# EAGLE schematic Orbiter_ENCODER_V4_0 (EAGLE 9.0.1)
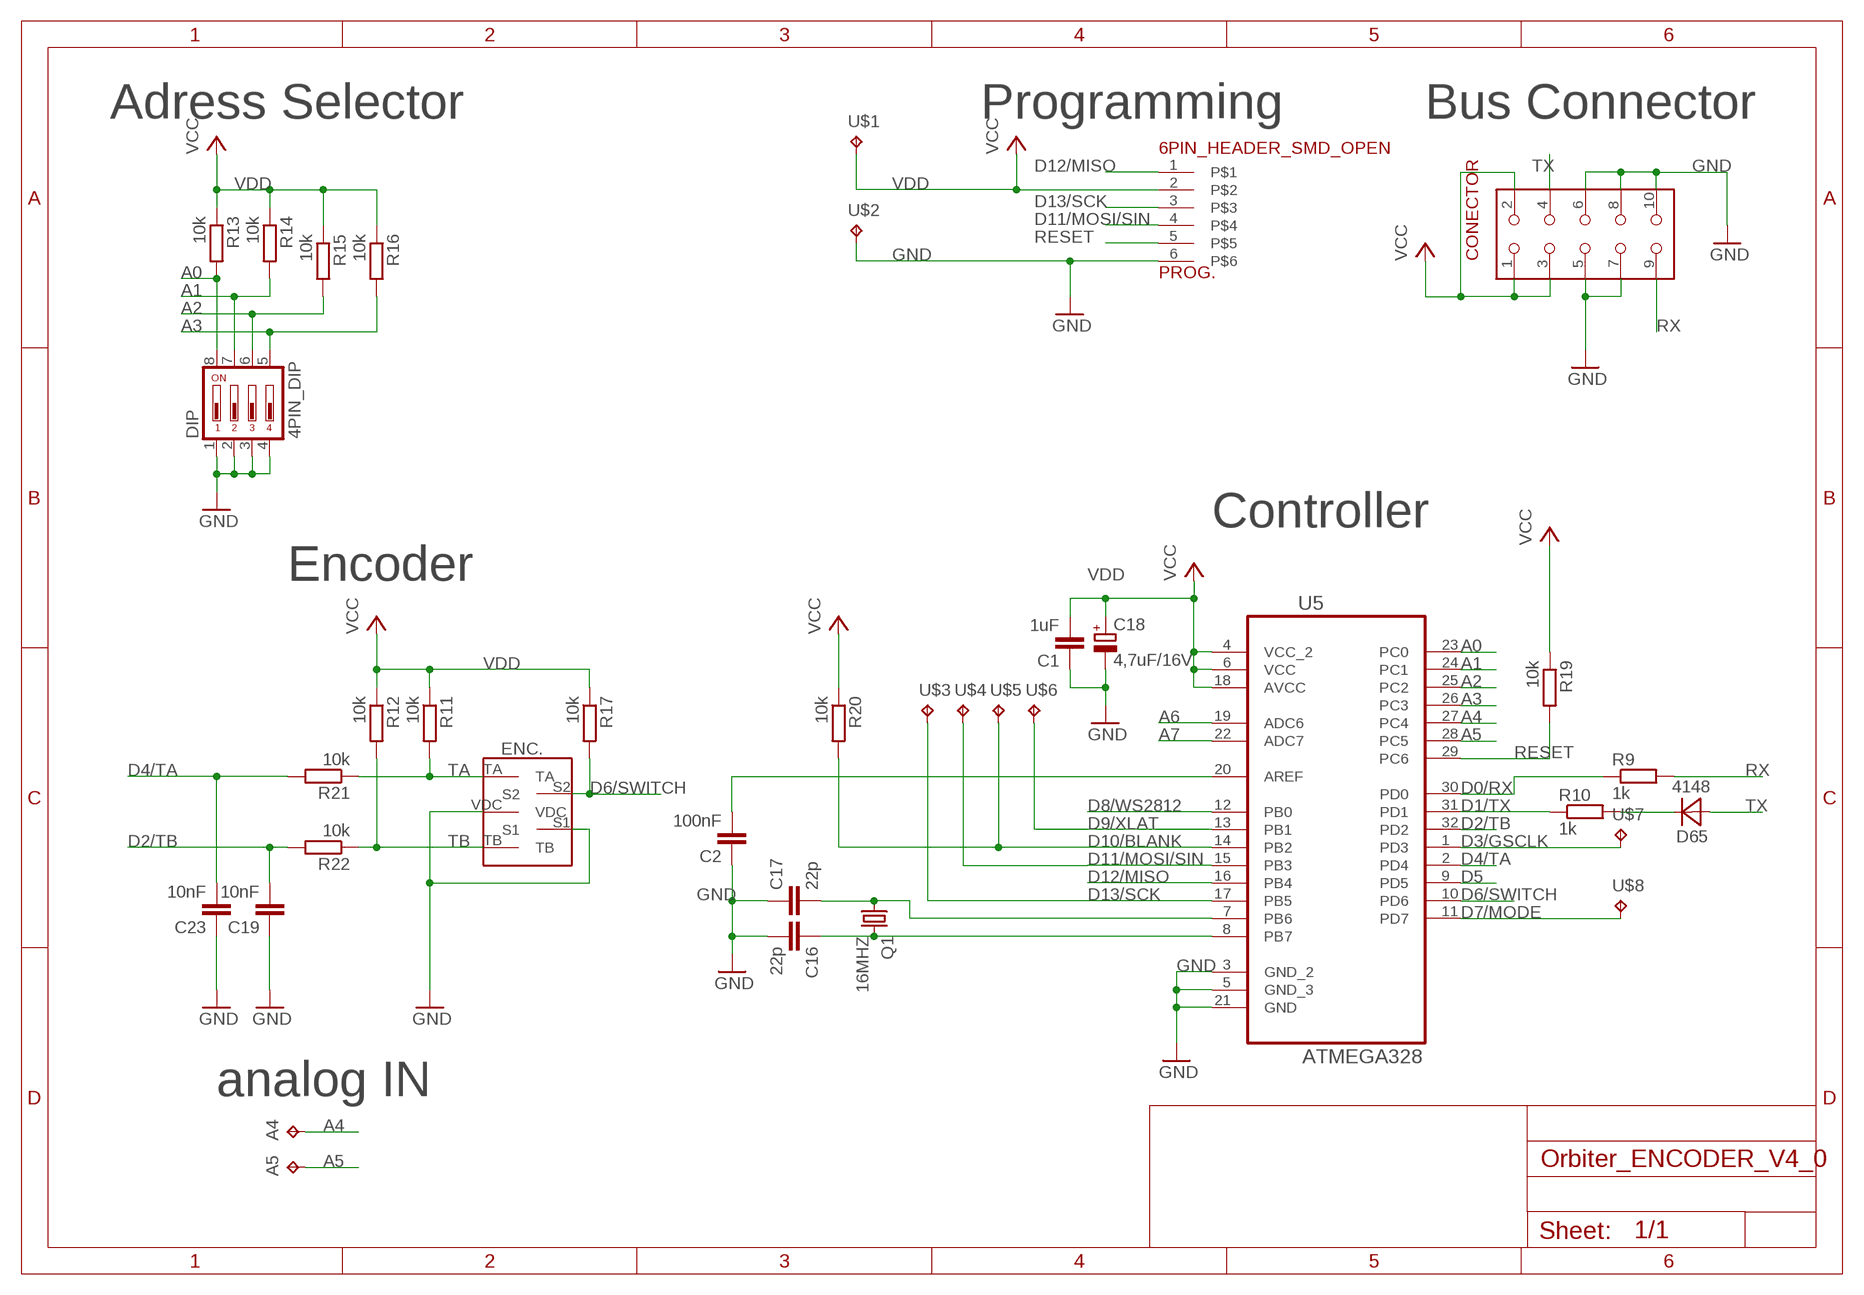
[diagram p0: schematic, sheet 1]

## Parts
A4  TP  [OVAL_PAD]
A5  TP  [OVAL_PAD]
C1  1uF  CAPACITOR"  [C0603]
C2  100nF  CAPACITOR"  [C0603]
C16  22p  CAPACITOR"  [C0603]
C17  22p  CAPACITOR"  [C0603]
C18  4,7uF/16V  SMD_ELCTROLYTIC  [153CLV-0605]
C19  10nF  CAPACITOR"  [C0603]
C23  10nF  CAPACITOR"  [C0603]
CONECTOR  10PIN_HEADER_SMD  [87832-10]
D65  4148  [SOD323-R]
DIP  4PIN_DIP  [CTS-219-04]
ENC.  BOURNS_ENCODER  [BOURNS_ENCODER_SMD]
PROG.  6PIN_HEADER_SMD_OPEN  [6PIN_HEADER_SMD_OPEN]
Q1  16MHZ  CRYSTAL_SM49  [SM49]
R9  1k  RESISTOR"  [R0805]
R10  1k  RESISTOR"  [R0805]
R11  10k  RESISTOR"  [R0805]
R12  10k  RESISTOR"  [R0805]
R13  10k  RESISTOR"  [R0805]
R14  10k  RESISTOR"  [R0805]
R15  10k  RESISTOR"  [R0805]
R16  10k  RESISTOR"  [R0805]
R17  10k  RESISTOR"  [R0805]
R19  10k  RESISTOR"  [R0805]
R20  10k  RESISTOR"  [R0805]
R21  10k  RESISTOR"  [R0805]
R22  10k  RESISTOR"  [R0805]
U5  ATMEGA328  ATMEGA328P-AU  [QFP80P900X900X120-32N]
U$1  TP  [OVAL_PAD]
U$2  TP  [OVAL_PAD]
U$3  TP  [OVAL_PAD]
U$4  TP  [OVAL_PAD]
U$5  TP  [OVAL_PAD]
U$6  TP  [OVAL_PAD]
U$7  TP  [OVAL_PAD]
U$8  TP  [OVAL_PAD]

## Nets
A0: DIP.8 R13.2 U5.23(PC0)
A1: DIP.7 R14.2 U5.24(PC1)
A2: DIP.6 R15.2 U5.25(PC2)
A3: DIP.5 R16.2 U5.26(PC3)
A4: A4.P$1(TP) U5.27(PC4)
A5: A5.P$1(TP) U5.28(PC5)
A6: U5.19(ADC6)
A7: U5.22(ADC7)
D0/RX: R9.1 U5.30(PD0)
D1/TX: R10.1 U5.31(PD1)
D2/TB: C19.2 R22.2 U5.32(PD2)
D3/GSCLK: U5.1(PD3) U$7.P$1(TP)
D4/TA: C23.2 R21.2 U5.2(PD4)
D5: U5.9(PD5)
D6/SWITCH: ENC..S2 R17.2 U5.10(PD6)
D7/MODE: U5.11(PD7) U$8.P$1(TP)
D8/WS2812: U5.12(PB0)
D9/XLAT: U5.13(PB1) U$6.P$1(TP)
D10/BLANK: R20.2 U5.14(PB2) U$5.P$1(TP)
D11/MOSI/SIN: PROG..4 U5.15(PB3) U$4.P$1(TP)
D12/MISO: PROG..1 U5.16(PB4)
D13/SCK: PROG..3 U5.17(PB5) U$3.P$1(TP)
GND: C1.1 C2.1 C16.2 C17.1 C18.- C19.1 C23.1 CONECTOR.5 CONECTOR.6 CONECTOR.7 CONECTOR.8 CONECTOR.10 DIP.1 DIP.2 DIP.3 DIP.4 ENC..S1 ENC..VDC PROG..6 U5.3(GND_2) U5.5(GND_3) U5.21(GND) U$2.P$1(TP)
N$77: D65.C R10.2
N$81: C17.2 Q1.1 U5.7(PB6)
N$82: C16.1 Q1.2 U5.8(PB7)
N$90: C2.2 U5.20(AREF)
RESET: PROG..5 R19.2 U5.29(PC6)
RX: CONECTOR.9 R9.2
TA: ENC..TA R11.2 R21.1
TB: ENC..TB R12.2 R22.1
TX: CONECTOR.4 D65.A
VDD: C1.2 C18.+ CONECTOR.1 CONECTOR.2 CONECTOR.3 PROG..2 R11.1 R12.1 R13.1 R14.1 R15.1 R16.1 R17.1 R19.1 R20.1 U5.4(VCC_2) U5.6(VCC) U5.18(AVCC) U$1.P$1(TP) ; supply symbol labelled VCC

## Notes on the sheet
- Adress Selector | Programming | Bus Connector
- Controller
- Encoder
- analog IN

## Library data of the parts
A4 A5 U$1-U$8 = C_Sager_Bibliothek:TP
C1 C2 C16 C17 C19 C23 = C_Sager_Bibliothek:CAPACITOR: capacitor
C18 = C_Sager_Bibliothek:SMD_ELCTROLYTIC: SMD Elektrolyt Kondensator 153CLV-0605
CONECTOR = C_Sager_Bibliothek:10PIN_HEADER_SMD: 10 Pin Header (Flachbandkabel)
D65 = C_Sager_Bibliothek:4148: Standard 4148 Diode SOD323 Format
DIP = C_Sager_Bibliothek:4PIN_DIP: 4 Bit DipSwitch
ENC. = C_Sager_Bibliothek:BOURNS_ENCODER: Bourns Rotay Encoder (Rückseitig)
PROG. = C_Sager_Bibliothek:6PIN_HEADER_SMD_OPEN: 6 Pin Header SMD
Q1 = C_Sager_Bibliothek:CRYSTAL_SM49: Quarz in SM49
R9-R17 R19-R22 = C_Sager_Bibliothek:RESISTOR: +/- 5 % resistor
U5 = C_Sager_Bibliothek:ATMEGA328P-AU: 8-bit Microcontroller with In-System Programmable Flash; MPN: ATMEGA328P-AU; OC_FARNELL: 1715486; OC_NEWARK: 14R4631; PACKAGE: TQFP-32; SUPPLIER: Atmel